# EAGLE design lo (EAGLE 6.3)
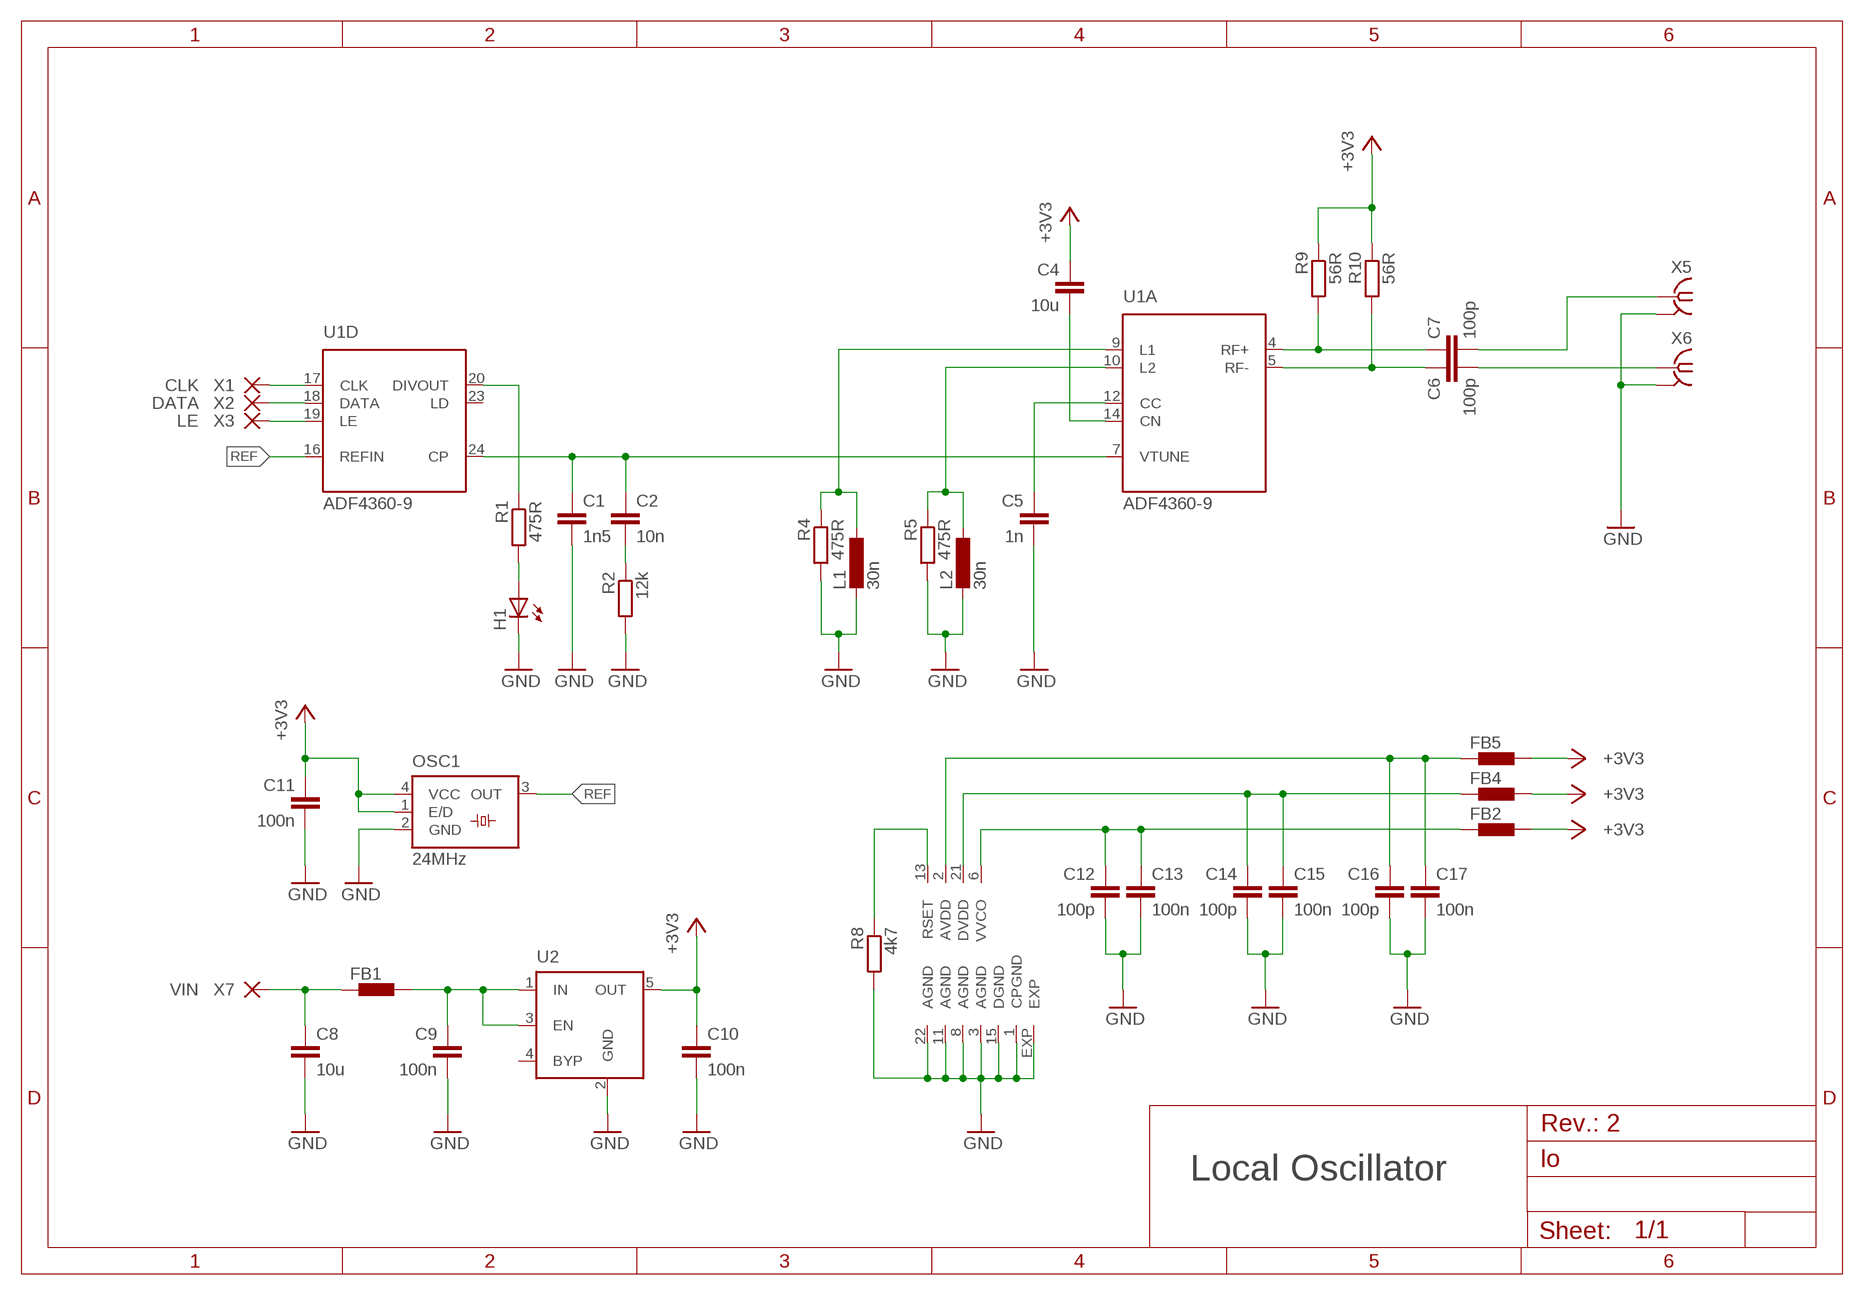
[diagram p0: schematic, sheet 1]

## Parts
C1  1n5  C-EUC0402  [C0402]
C2  10n  C-EUC0603  [C0603]
C4  10u  C-EUC0805  [C0805]
C5  1n  C-EUC0603  [C0603]
C6  100p  C-EUC0402  [C0402]
C7  100p  C-EUC0402  [C0402]
C8  10u  C-EUC0805  [C0805]
C9  100n  C-EUC0603  [C0603]
C10  100n  C-EUC0603  [C0603]
C11  100n  C-EUC0603  [C0603]
C12  100p  C-EUC0603  [C0603]
C13  100n  C-EUC0603  [C0603]
C14  100p  C-EUC0603  [C0603]
C15  100n  C-EUC0603  [C0603]
C16  100p  C-EUC0603  [C0603]
C17  100n  C-EUC0603  [C0603]
FB1  BML15H  [R0603]
FB2  BML15H  [R0603]
FB4  BML15H  [R0603]
FB5  BML15H  [R0603]
H1  PL006-WCR13  [SOT23]
L1  30n  L-EUL2012C  [L2012C]
L2  30n  L-EUL2012C  [L2012C]
OSC1  24MHz  SM77H  [SM77H]
R1  475R  R-EU_R1206  [R1206]
R2  12k  R-EU_R0603  [R0603]
R4  475R  R-EU_R0603  [R0603]
R5  475R  R-EU_R0603  [R0603]
R8  4k7  R-EU_R0603  [R0603]
R9  56R  R-EU_R0603  [R0603]
R10  56R  R-EU_R0603  [R0603]
U1  ADF4360-9  ADF4360  [LFCSP24]
U2  MIC5219XX  [SOT23-5]
X1  CLK  SMD2  [SMD1,27-2,54]
X2  DATA  SMD2  [SMD1,27-2,54]
X3  LE  SMD2  [SMD1,27-2,54]
X5  SMA-142-0701-881/886  [J502-ND-142-0701-881/886]
X6  SMA-142-0701-881/886  [J502-ND-142-0701-881/886]
X7  VIN  SMD2  [SMD1,27-2,54]

## Nets
+3V3: C4.1 C10.1 C11.1 FB2.2 FB4.2 FB5.2 OSC1.1(E/D) OSC1.4(VCC) R9.1 R10.1 U2.5(OUT)
GND: C1.2 C5.2 C8.2 C9.2 C10.2 C11.2 C12.2 C13.2 C14.2 C15.2 C16.2 C17.2 H1.3(C) L1.2 L2.2 OSC1.2(GND) R2.2 R4.2 R5.2 R8.2 U1.1(P:CPGND) U1.3(P:AGND) U1.8(P:AGND) U1.11(P:AGND) U1.15(P:DGND) U1.22(P:AGND) U1.EXP(P:EXP) U2.2(GND) X5.G@1(GND) X6.G@1(GND)
LD: C1.1 C2.1 U1.7(A:VTUNE) U1.24(D:CP)
N$1: U1.17(D:CLK) X1.1(P)
N$2: U1.18(D:DATA) X2.1(P)
N$3: U1.19(D:LE) X3.1(P)
N$4: C9.1 FB1.2 U2.1(IN) U2.3(EN)
N$5: R1.1 U1.20(D:DIVOUT)
N$6: H1.1(A) R1.2
N$9: C2.2 R2.1
N$12: C7.2 X5.1
N$13: L2.1 R5.1 U1.10(A:L2)
N$14: C6.2 X6.1
N$15: C5.1 U1.12(A:CC)
N$16: C8.1 FB1.1 X7.1(P)
N$17: C4.2 U1.14(A:CN)
N$19: C7.1 R9.2 U1.4(A:RF+)
N$20: C6.1 R10.2 U1.5(A:RF-)
N$29: R8.1 U1.13(P:RSET)
N$30: C12.1 C13.1 FB2.1 U1.6(P:VVCO)
N$33: C14.1 C15.1 FB4.1 U1.21(P:DVDD)
N$35: C16.1 C17.1 FB5.1 U1.2(P:AVDD)
REF: OSC1.3(OUT) U1.16(D:REFIN)
RUT: L1.1 R4.1 U1.9(A:L1)
Unconnected: U1.23(D:LD) U2.4(BYP)

## Notes on the sheet
- Rev.: 2
- Local Oscillator

## Power pins joined to a net without a drawn wire
GND: X5.G@2(GND) X5.G@3(GND) X5.G@4(GND) X6.G@2(GND) X6.G@3(GND) X6.G@4(GND)

## Library data of the parts
C1 C2 C4-C17 = rcl:C-EU: CAPACITOR, European symbol
FB1 FB2 FB4 FB5 = ferrite-bead:BML15H: EMIFIL (R) Chip Ferrite Bead for GHz Noise Source: http://www.murata.com/ Ferrite Bead BLM15H.pdf
H1 = led:PL006*: PLH006 Series SMD LED SOT23 PLH006-WCR21 Super Red PLH006-WCR12 High Eff Red PLH006-WCG13 Green PLH006-WCY01 Yellow www.p-tec.net Source: http://www.wittig-electronic.de/PTEC/PL006Series.pdf
L1 L2 = rcl:L-EU: INDUCTOR, European symbol
OSC1 = crystal:SM77H: 3.3V CMOS Clock Oscillator Source: www.pletronics.com .. sm77h%203.3v.pdf; OC_FARNELL: unknown; OC_NEWARK: unknown
R1 R2 R4 R5 R8-R10 = rcl:R-EU_: RESISTOR, European symbol
U1 = adf4360:ADF4360
U2 = v-reg-micrel:MIC5219XX: VOLTAGE REGULATOR; OC_FARNELL: unknown; OC_NEWARK: unknown
X1-X3 X7 = wirepad:SMD2: SMD PAD
X5 X6 = con-coax:SMA-: SMA 50 Ohm End Launch Jack Receptacle - Round Contact Johnson Components Source: www.johnsoncomponents.com .. J502-ND.pdf; MF: JOHNSON COMPONENTS; MPN: 142-0701-881; OC_FARNELL: 1608603; OC_NEWARK: 08B906

## Board
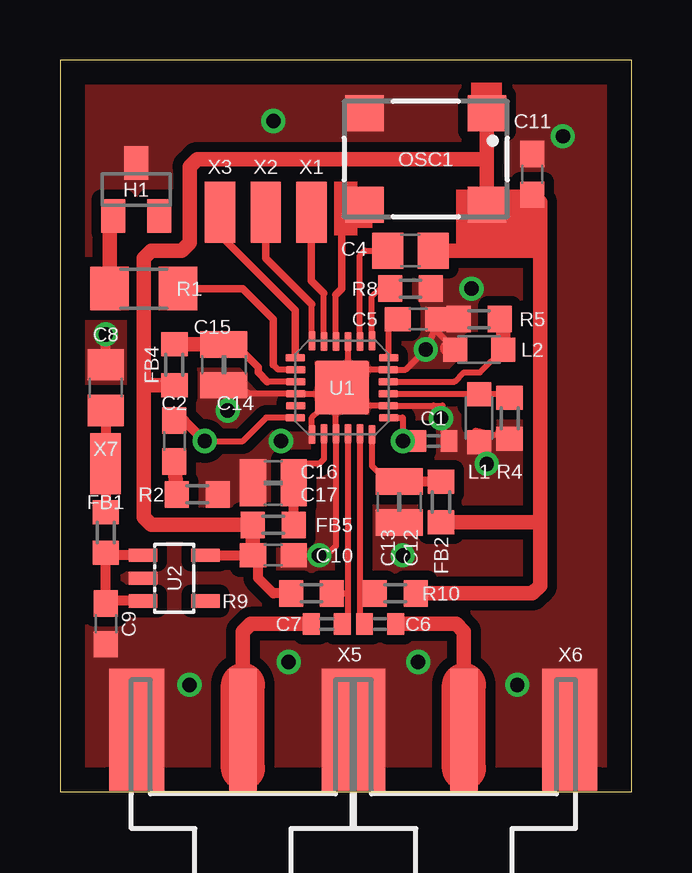
[diagram p1: board, top side]
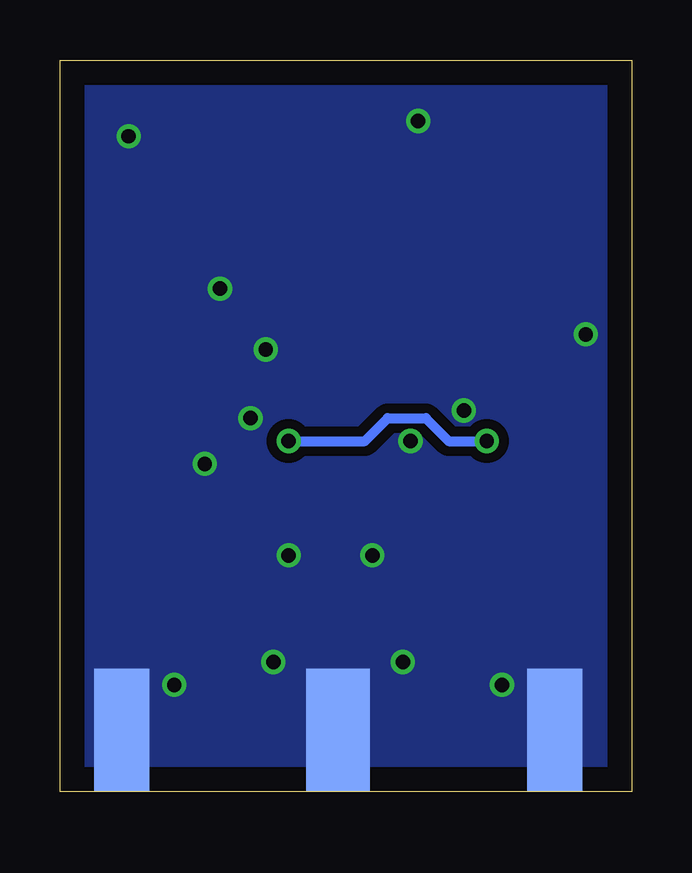
[diagram p2: board, bottom side, seen from below]

Size 23.81 x 30.48 mm. Coordinates in mm from the lower left corner, seen from the top.
Outline: 23.81,0 23.81,30.48 0,30.48 0,0 23.81,0
Copper layers (1*16): Top 0.035mm / dielectric 1.5mm / Bottom 0.035mm
Design rules "default *": minimum track width 10mil, minimum drill 24mil, track to track 8mil, track to pad 8mil, pad to pad 8mil, via to via 8mil, smd to smd 8mil, copper to edge 40mil, drill to drill 8mil, minimum pad ring 10mil, minimum via ring 8mil, stop-mask expansion 4mil, vias tented up to drill 0mil, thermal gap 10mil
tRestrict: area 17.1,15.2 to 17.8,15.9; area 17.1,18.1 to 17.8,18.7

### Footprints (pad centres in the part's own frame; a part is rotated, then mirrored left to right if it is on the bottom)
C0402 = smd 0.7 x 0.9: 1 -0.65,0; 2 0.65,0
C0603 = smd 1.1 x 1: 1 -0.85,0; 2 0.85,0
C0805 = smd 1.3 x 1.5: 1 -0.95,0; 2 0.95,0
R0603 = smd 1 x 1.1: 1 -0.85,0; 2 0.85,0
SOT23 = smd 1 x 1.4: 1 -0.95,-1.1; 2 0.95,-1.1; 3 0,1.1
L2012C = smd 1 x 1: 1 -1,0; 2 1,0
SM77H = smd 1.6 x 1.5: 1 -2.55,-1.9; 2 2.55,-1.9; 3 2.55,1.9; 4 -2.55,1.9
R1206 = smd 1.6 x 1.803: 1 -1.422,0; 2 1.422,0
LFCSP24 = smd 0.8 x 0.3: 1 -1.95,1.25; 2 -1.925,0.75; 3 -1.925,0.25; 4 -1.925,-0.25; 5 -1.925,-0.75; 6 -1.95,-1.25; 13 1.95,-1.25; 14 1.925,-0.75; 15 1.925,-0.25; 16 1.925,0.25; 17 1.925,0.75; 18 1.95,1.25 | smd 0.3 x 0.8: 7 -1.25,-1.95; 8 -0.75,-1.925; 9 -0.25,-1.925; 10 0.25,-1.925; 11 0.75,-1.925; 12 1.25,-1.95; 19 1.25,1.95; 20 0.75,1.925; 21 0.25,1.925; 22 -0.25,1.925; 23 -0.75,1.925; 24 -1.25,1.95 | smd 2.25 x 2.25: EXP 0,0
SOT23-5 = smd 0.55 x 1.2: 1 -0.95,-1.3; 2 0,-1.3; 3 0.95,-1.3; 4 0.95,1.3; 5 -0.95,1.3
SMD1,27-2,54 = smd 1.27 x 2.54: 1 0,0
J502-ND-142-0701-881/886 = smd 5.08 x 1.143: 1 2.565,0 | smd 5.08 x 2.286: G@1 2.565,4.42; G@2 2.565,-4.42 | smd 5.08 x 2.286 bottom: G@3 2.565,4.42; G@4 2.565,-4.42

### Placement (x,y rotation side)
C1  15.56,14.61 0 top
C2  4.76,14.61 270 top
C4  14.6,22.54 180 top
C5  14.92,19.68 0 top
C6  13.34,6.99 0 top
C7  11.11,6.99 180 top
C8  1.91,16.83 90 top
C9  1.91,6.99 270 top
C10  8.89,9.84 0 top
C11  19.68,25.72 90 top
C12  14.61,12.06 270 top
C13  13.65,12.06 270 top
C14  7.3,17.78 270 top
C15  6.35,17.78 270 top
C16  8.89,13.34 180 top
C17  8.89,12.38 180 top
FB1  1.91,10.79 270 top
FB2  15.88,12.06 270 top
FB4  4.76,17.78 270 top
FB5  8.89,11.11 180 top
H1  3.17,25.08 0 top
L1  17.46,15.56 270 top
L2  17.46,18.41 180 top
OSC1  15.24,26.35 180 top
R1  3.49,20.95 180 top
R2  5.71,12.38 0 top
R4  18.73,15.56 270 top
R5  17.46,19.68 180 top
R8  14.61,20.95 0 top
R9  10.48,8.26 0 top
R10  13.97,8.26 180 top
U1  11.75,16.83 90 top
U2  4.76,8.89 270 top
X1  10.48,24.13 180 top
X2  8.57,24.13 180 top
X3  6.67,24.13 180 top
X5  7.62,0 90 top
X6  16.83,0 90 top
X7  1.91,13.65 180 top

### Tracks (layer width: path | path; a pad name or v marks a point on that pad's centre or on a via)
+3V3
  Top 0.406: 17.78,25.72 17.79,25.71 OSC1.4 | OSC1.1 17.79,26.36 17.78,26.35 | U2.5 C10.1 8.26,9.63 8.26,8.89 8.89,8.26 R9.1
  Top 0.61: 17.78,26.35 OSC1.1 17.78,28.26 OSC1.1 | 17.78,25.72 OSC1.4 | 17.78,26.35 17.78,26.04 17.78,26.03 17.78,25.72 | C11.1 19.69,24.45 OSC1.4 | 19.68,24.45 C11.1 | FB4.2 3.71,16.93 3.49,17.14 | 3.49,17.14 3.49,11.43 3.81,11.11 FB5.2 C10.1 | R10.1 19.68,8.26 20,8.57 20,11.11 | FB2.2 19.9,11.21 20,11.11 | 20,11.11 20,22.54 | C4.1 20,22.54 | 17.78,26.35 5.71,26.35 5.4,26.04 5.4,22.86 5.08,22.54 3.81,22.54 3.49,22.23 3.49,17.14 | 20,22.54 20,24.55 C11.1
GND  (via drill 0.6)
  Top 0.254: 11.5,15.88 11.5,16.58 | U1.1 10.5,15.58 10.79,15.88 11.5,15.88 | 11.5,16.58 U1.22 7.94,16.58 | U1.15 12,17.08 U1.EXP | U1.EXP 12.5,17.58 U1.11 14.4,17.58 15.26,18.43 C5.2 | U1.EXP 12.5,16.08 U1.8 15.56,16.08 | 11.11,9.84 11.5,10.23 U1.3 11.5,15.88 | 11.5,16.58 U1.EXP | 15.56,16.08 15.94,16.08 | C1.2 15.56,16.08 | R4.2 17.3,15.03 L1.2 | 15.34,19.54 L2.2 | 7.94,16.58 7.22,16.58 C15.2 | C14.2 7.94,16.58
  Top 0.406: C8.2 v1.91,19.05
  Top 0.61: 16.14,18.46 16.19,18.41
  other vias: 10.79,9.84 15.88,15.56 17.78,13.65 17.14,20.95 8.89,27.94 20.95,27.3 14.29,9.84 14.92,5.4 9.53,5.4 5.4,4.45 19.05,4.45 9.21,14.61 6.99,15.88 15.24,18.41
  pour Bottom (isolate 0.406, no thermals): -0.32,30.16 23.81,30.16 23.81,0 -0.32,0
  pour Top (isolate 0.406, no thermals): -0.32,30.16 23.81,30.16 23.81,0 -0.32,0
LD  (via drill 0.6)
  Top 0.254: U1.7 14.27,15.58 14.29,15.56 v14.29,14.61 14.3,14.59 C1.1 | U1.24 8.59,15.58 7.62,14.61 v6.03,14.61
  Top 0.406: C2.1 5.18,15.46 v6.03,14.61
  Bottom 0.406: v14.29,14.61 11.11,14.61 10.16,15.56 8.57,15.56 7.62,14.61 v6.03,14.61
N$1
  Top 0.254: U1.17 11,20.75
  Top 0.305: 11,20.75 10.48,21.27 X1.1
N$2
  Top 0.254: U1.18 10.5,20.3
  Top 0.305: 10.5,20.3 8.57,22.23 X2.1
N$3
  Top 0.305: U1.19 9.8,20.05 6.67,23.18 X3.1
N$4
  Top 0.406: U2.1 2.01,9.84 FB1.2 C9.1 2.01,7.94 U2.3
N$5
  Top 0.254: U1.20 9.09,17.58 8.89,17.78
  Top 0.305: 8.89,17.78 8.89,19.68 7.62,20.95 R1.1
N$6
  Top 0.61: R1.2 2.07,23.83 H1.1
N$9
  Top 0.61: R2.1 C2.2
N$12
  Top 0.61: C7.2 7.94,6.99 7.62,6.67 7.62,4.45 X5.1
  Top 1.829: 7.62,0.95 7.62,4.45
N$13
  Top 0.254: U1.10 16.44,17.08 16.83,17.46 17.51,17.46 L2.1 18.41,18.37
  Top 0.61: L2.1 18.46,19.54 R5.1
N$14
  Top 0.61: C6.2 16.51,6.99 16.83,6.67 16.83,4.45 X6.1
  Top 1.829: 16.83,0.95 16.83,4.45
N$15
  Top 0.254: U1.12 13.7,19.43 C5.1
N$16
  Top 0.406: C8.1 X7.1 FB1.1
N$17
  Top 0.254: U1.14 12.5,22.34 12.7,22.54 C4.2
N$19
  Top 0.254: U1.4 12,8.26 | 12,8.26 12,7.22 C7.1 | R9.2 12,8.26
N$20
  Top 0.254: U1.5 12.5,8.26 | 12.5,8.26 12.5,7.17 C6.1 | R10.2 12.5,8.26
N$29
  Top 0.254: U1.13 13,20.62 13.34,20.95 R8.1
N$30
  Top 0.254: U1.6 13,13.57 C13.1
  Top 0.406: FB2.1 C12.1 C13.1
N$33
  Top 0.254: U1.21 8.64,17.08
  Top 0.305: 8.64,17.08 8.26,17.46 8.26,17.68 C14.1
  Top 0.61: FB4.1 C15.1 C14.1
N$35
  Top 0.254: U1.2 11,13.86 10.79,13.65 10.06,13.65 C16.1
  Top 0.406: FB5.1 C17.1 C16.1
REF
  Top 0.254: U1.16 11.5,20.7 | 11.75,23.51 OSC1.3
  Top 0.305: 11.5,20.7 11.75,20.95 11.75,23.51
RUT
  Top 0.254: U1.9 17.14,16.58 | 17.14,16.58 18.27,16.58 R4.1 | L1.1 17.14,16.58
(copper drawn outside any net)
  shapes: Top area x5

### Text on the board
tDocu: LE | DATA | CLK